# EAGLE design drinkshield01 (EAGLE 5.10)
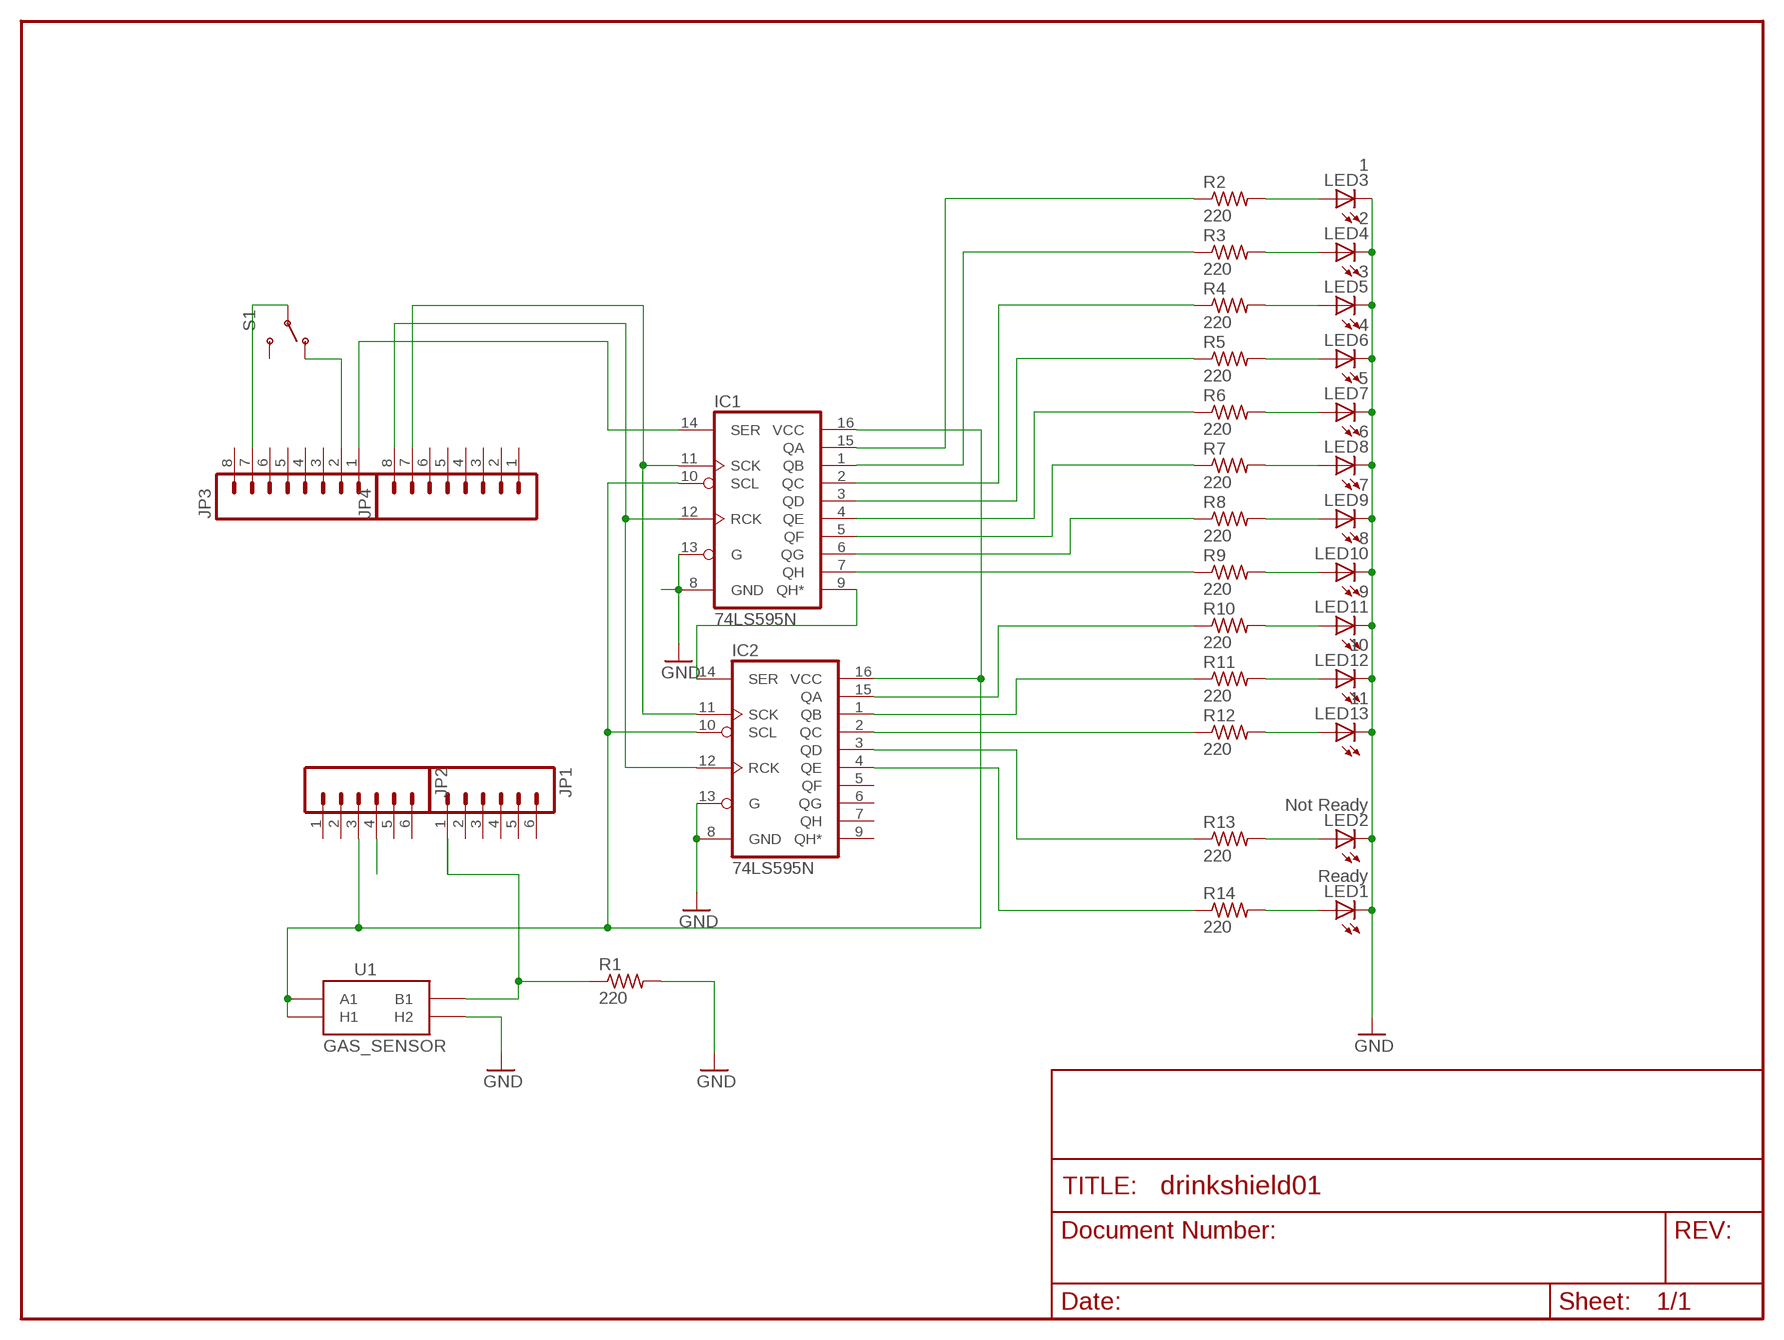
[diagram p0: schematic, sheet 1]

## Parts
IC1  74LS595N  [DIL16]
IC2  74LS595N  [DIL16]
JP1  M06LOCK  [1X06_LOCK]
JP2  M06LOCK  [1X06_LOCK]
JP3  M08LOCK  [1X08_LOCK]
JP4  M08LOCK  [1X08_LOCK]
LED1  Ready  LED5MM  [LED5MM]
LED2  Not Ready  LED5MM  [LED5MM]
LED3  1  LED5MM  [LED5MM]
LED4  2  LED5MM  [LED5MM]
LED5  3  LED5MM  [LED5MM]
LED6  4  LED5MM  [LED5MM]
LED7  5  LED5MM  [LED5MM]
LED8  6  LED5MM  [LED5MM]
LED9  7  LED5MM  [LED5MM]
LED10  8  LED5MM  [LED5MM]
LED11  9  LED5MM  [LED5MM]
LED12  10  LED5MM  [LED5MM]
LED13  11  LED5MM  [LED5MM]
R1  220  R-US_0207/10  [0207/10]
R2  220  R-US_0207/10  [0207/10]
R3  220  R-US_0207/10  [0207/10]
R4  220  R-US_0207/10  [0207/10]
R5  220  R-US_0207/10  [0207/10]
R6  220  R-US_0207/10  [0207/10]
R7  220  R-US_0207/10  [0207/10]
R8  220  R-US_0207/10  [0207/10]
R9  220  R-US_0207/10  [0207/10]
R10  220  R-US_0207/10  [0207/10]
R11  220  R-US_0207/10  [0207/10]
R12  220  R-US_0207/10  [0207/10]
R13  220  R-US_0207/10  [0207/10]
R14  220  R-US_0207/10  [0207/10]
S1  SWITCH-SPSTPTH  [SWITCH-SPDT]
U1  GAS_SENSOR  [MQ-3]

## Nets
GND: IC1.8(GND) IC1.13(G) IC2.8(GND) IC2.13(G) JP2.4 JP3.7 LED1.K(C) LED2.K(C) LED3.K(C) LED4.K(C) LED5.K(C) LED6.K(C) LED7.K(C) LED8.K(C) LED9.K(C) LED10.K(C) LED11.K(C) LED12.K(C) LED13.K(C) R1.2 S1.2(P) U1.HB(H2)
N$1: LED13.A R12.2
N$2: LED12.A R11.2
N$3: LED11.A R10.2
N$4: LED10.A R9.2
N$5: LED9.A R8.2
N$6: LED8.A R7.2
N$7: LED7.A R6.2
N$8: LED6.A R5.2
N$9: LED5.A R4.2
N$10: LED4.A R3.2
N$11: LED3.A R2.2
N$12: IC2.15(QA) R10.1
N$13: IC2.1(QB) R11.1
N$14: IC1.1(QB) R3.1
N$15: LED1.A R14.2
N$16: IC1.14(SER) JP3.1
N$17: IC1.9(QH*) IC2.14(SER)
N$18: IC1.12(RCK) IC2.12(RCK) JP4.8
N$19: IC1.11(SCK) IC2.11(SCK) JP4.7
N$20: IC1.6(QG) R8.1
N$21: LED2.A R13.2
N$23: IC1.15(QA) R2.1
N$24: IC1.2(QC) R4.1
N$25: IC1.3(QD) R5.1
N$26: IC1.4(QE) R6.1
N$27: IC1.5(QF) R7.1
N$28: JP1.1 R1.1 U1.B1
N$29: IC1.7(QH) R9.1
N$30: JP3.2 S1.1(O)
N$31: IC2.2(QC) R12.1
N$32: IC2.3(QD) R13.1
N$33: IC2.4(QE) R14.1
VCC: IC1.10(SCL) IC1.16(VCC) IC2.10(SCL) IC2.16(VCC) JP2.3 U1.A1 U1.HA(H1)
Unconnected: IC2.5(QF) IC2.6(QG) IC2.7(QH) IC2.9(QH*) JP1.2 JP1.3 JP1.4 JP1.5 JP1.6 JP2.1 JP2.2 JP2.5 JP2.6 JP3.3 JP3.4 JP3.5 JP3.6 JP3.8 JP4.1 JP4.2 JP4.3 JP4.4 JP4.5 JP4.6 S1.3(S)

## Library data of the parts
IC1 IC2 = SparkFun:74*595: 8-bit SHIFT REGISTER, output latch
JP1 JP2 = SparkFun:M06: Header 6 Standard 6-pin 0.1" header. Use with straight break away headers (SKU : PRT-00116), right angle break away headers (PRT-00553), swiss pins (PRT-00743), machine pins (PRT-00117), and female headers (PRT-00115). Molex polarized connector foot print use with SKU : PRT-08094 with associated crimp pins and housings. NOTES ON THE VARIANTS LOCK and LOCK_LONGPADS... This footprint was designed to help hold the alignment of a through-hole component (i.e. 6-pin header) while soldering it into place. You may notice that each hole has been shifted either up or down by 0.005 of an inch from it's more standard position (which is a perfectly straight line). This slight alteration caused the pins (the squares in the middle) to touch the edges of the holes. Because they are alternating, it causes a "brace" to hold the component in place. 0.005 has proven to be the perfect amount of "off-center" position when using our standard breakaway headers. Although looks a little odd when you look at the bare footprint, once you have a header in there, the alteration is very hard to notice. Also, if you push a header all the way into place, it is covered up entirely on the bottom side. This idea of altering the position of holes to aid alignment will be further integrated into the Sparkfun Library for other footprints. It can help hold any component with 3 or more connection pins.
JP3 JP4 = SparkFun:M08: Header 8 Standard 8-pin 0.1" header. Use with straight break away headers (SKU : PRT-00116), right angle break away headers (PRT-00553), swiss pins (PRT-00743), machine pins (PRT-00117), and female headers (PRT-00115).
LED1-LED13 = adafruit:LED: LED OSRAM: - CHIPLED LG R971, LG N971, LY N971, LG Q971, LY Q971, LO R971, LY R971 LH N974, LH R974 LS Q976, LO Q976, LY Q976 LO Q996 - Hyper CHIPLED LW Q18S LB Q993, LB Q99A, LB R99A - SideLED LS A670, LO A670, LY A670, LG A670, LP A670 LB A673, LV A673, LT A673, LW A673 LH A674 LY A675 LS A676, LA A676, LO A676, LY A676, LW A676 LS A679, LY A679, LG A679 - Hyper Micro SIDELED® LS Y876, LA Y876, LO Y876, LY Y876 LT Y87S - SmartLED LW L88C, LW L88S LB L89C, LB L89S, LG L890 LS L89K, LO L89K, LY L89K LS L896, LA L896, LO L896, LY L896 - TOPLED LS T670, LO T670, LY T670, LG T670, LP T670 LSG T670, LSP T670, LSY T670, LOP T670, LYG T670 LG T671, LOG T671, LSG T671 LB T673, LV T673, LT T673, LW T673 LH T674 LS T676, LA T676, LO T676, LY T676, LB T676, LH T676, LSB T676, LW T676 LB T67C, LV T67C, LT T67C, LS T67K, LO T67K, LY T67K, LW E67C LS E67B, LA E67B, LO E67B, LY E67B, LB E67C, LV E67C, LT E67C LW T67C LS T679, LY T679, LG T679 LS T770, LO T770, LY T770, LG T770, LP T770 LB T773, LV T773, LT T773, LW T773 LH T774 LS E675, LA E675, LY E675, LS T675 LS T776, LA T776, LO T776, LY T776, LB T776 LHGB T686 LT T68C, LB T68C - Hyper Mini TOPLED® LB M676 - Mini TOPLED Santana® LG M470 LS M47K, LO M47K, LY M47K Source: http://www.osram.convergy.de/
R1-R14 = adafruit:R-US_: RESISTOR, American symbol
S1 = SparkFun:SWITCH-SPST: SPST Switch Simple slide switch. Spark Fun Electronics SKU : COM-00102
U1 = SparkFun:GAS_SENSOR: MQ-3 Gas Sensor. FP not tested. Part#

## Board
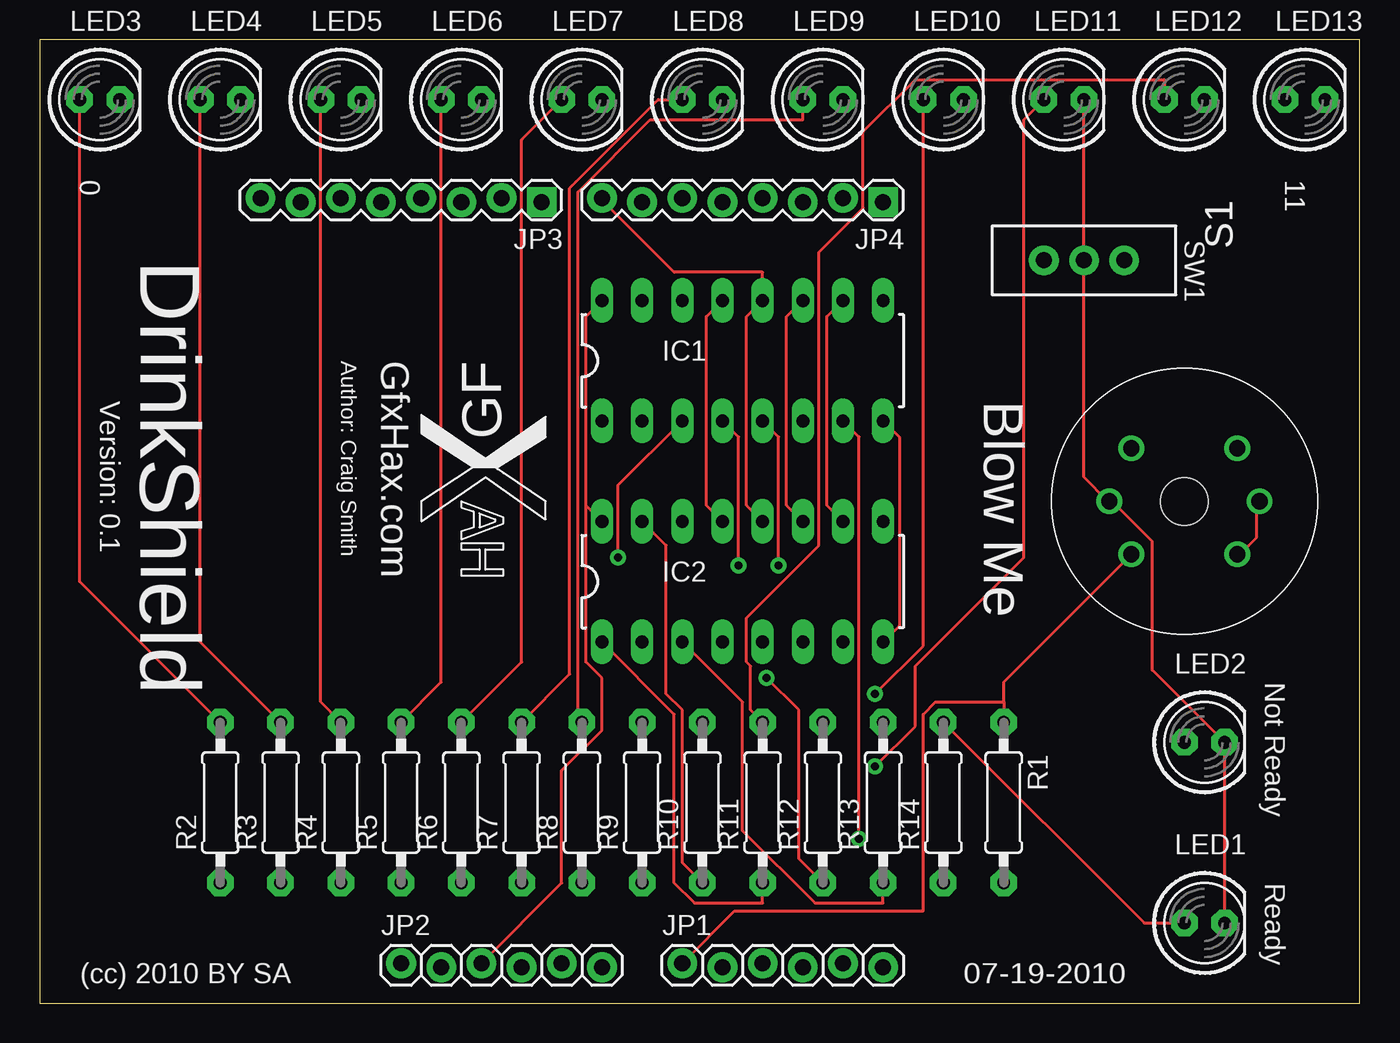
[diagram p1: board, top side]
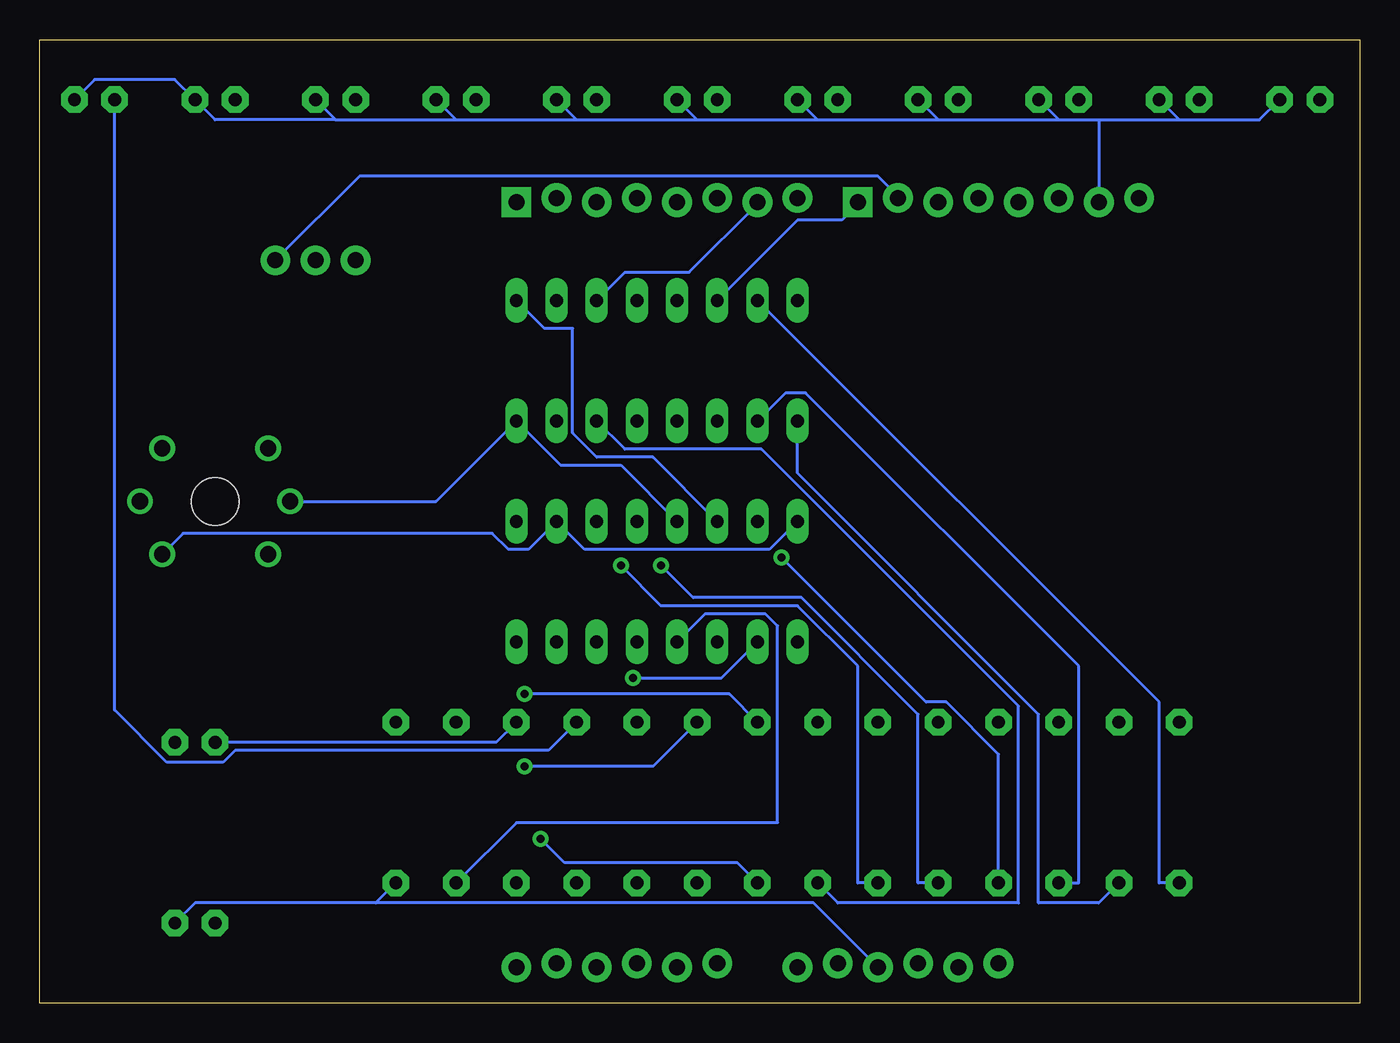
[diagram p2: board, bottom side, seen from below]

Size 83.49 x 60.95 mm. Coordinates in mm from the lower left corner, seen from the top.
Outline: 0,0 83.49,0 83.49,60.95 0,60.95 0,0
Copper layers (1*16): Top 0.035mm / dielectric 1.5mm / Bottom 0.035mm
Design rules "SparkFun": minimum track width 8mil, minimum drill 20mil, track to track 8mil, track to pad 8mil, pad to pad 8mil, via to via 8mil, smd to smd 8mil, copper to edge 10mil, drill to drill 8mil, minimum pad ring 12mil, minimum via ring 10mil, stop-mask expansion 4mil, vias tented up to drill 25mil, thermal gap 10mil

### Footprints (pad centres in the part's own frame; a part is rotated, then mirrored left to right if it is on the bottom)
DIL16 = drill 0.813 long: 1 -8.89,-3.81; 2 -6.35,-3.81; 3 -3.81,-3.81; 4 -1.27,-3.81; 5 1.27,-3.81; 6 3.81,-3.81; 7 6.35,-3.81; 8 8.89,-3.81; 9 8.89,3.81; 10 6.35,3.81; 11 3.81,3.81; 12 1.27,3.81; 13 -1.27,3.81; 14 -3.81,3.81; 15 -6.35,3.81; 16 -8.89,3.81
1X06_LOCK = drill 1.016 pad 1.88 round: 1 0,0; 2 2.54,-0.254; 3 5.08,0; 4 7.62,-0.254; 5 10.16,0; 6 12.7,-0.254
1X08_LOCK = drill 1.016 pad 1.88 square: 1 0,0.127 | drill 1.016 pad 1.88 round: 2 2.54,-0.127; 3 5.08,0.127; 4 7.62,-0.127; 5 10.16,0.127; 6 12.7,-0.127; 7 15.24,0.127; 8 17.78,-0.127
LED5MM = drill 0.813 pad 1.676 octagon: A -1.27,0; K 1.27,0
0207/10 = drill 0.813 pad 1.676 octagon: 1 -5.08,0; 2 5.08,0
SWITCH-SPDT = drill 1.016 pad 1.88 round: 1 0,2.54; 2 0,0; 3 0,-2.54
MQ-3 = drill 1.016 round: A1 -3.35,3.35; A2 -3.35,-3.35; B1 3.35,3.35; B2 3.35,-3.35; HA -4.75,0; HB 4.75,0 | hole 3: 0,0

### Placement (x,y rotation side)
IC1  44.45,40.64 0 top
IC2  44.45,26.67 0 top
JP1  40.64,2.54 0 top
JP2  22.86,2.54 0 top
JP3  31.75,50.8 180 top
JP4  53.34,50.8 180 top
LED1  73.66,5.08 0 top
LED2  73.66,16.51 0 top
LED3  3.81,57.15 0 top
LED4  11.43,57.15 0 top
LED5  19.05,57.15 0 top
LED6  26.67,57.15 0 top
LED7  34.29,57.15 0 top
LED8  41.91,57.15 0 top
LED9  49.53,57.15 0 top
LED10  57.15,57.15 0 top
LED11  64.77,57.15 0 top
LED12  72.39,57.15 0 top
LED13  80.01,57.15 0 top
R1  60.96,12.7 270 top
R2  11.43,12.7 90 top
R3  15.24,12.7 90 top
R4  19.05,12.7 90 top
R5  22.86,12.7 90 top
R6  26.67,12.7 90 top
R7  30.48,12.7 90 top
R8  34.29,12.7 90 top
R9  38.1,12.7 90 top
R10  41.91,12.7 90 top
R11  45.72,12.7 90 top
R12  49.53,12.7 90 top
R13  53.34,12.7 90 top
R14  57.15,12.7 90 top
S1  66.04,46.99 270 top
U1  72.39,31.75 180 top
U$1  [GFXHAX_LOGO]  26.67,40.64 270 top

### Tracks (layer width: path | path; a pad name or v marks a point on that pad's centre or on a via)
GND
  Top 0.203: LED1.K LED2.K 70.36,21.08 70.36,29.21 67.82,31.75 U1.HB 67.56,31.75 66.04,33.27 S1.2 LED11.K | IC2.8 54.36,23.88 54.36,35.81 IC1.8 | IC1.13 42.16,43.43 42.16,31.5 IC2.13
  Bottom 0.203: 62.23,6.35 R1.2 | 62.23,6.35 73.66,6.35 LED1.K | JP2.4 34.54,6.35 62.23,6.35 | IC2.13 46.74,34.04 50.55,34.04 IC1.8 58.42,31.75 U1.HB | LED3.K 6.35,55.88 11.43,55.88 | 11.43,55.88 LED4.K | 19.05,55.88 LED5.K | 16.51,55.88 11.43,55.88 | 19.05,55.88 16.51,55.88 | 26.67,55.88 LED6.K | 26.67,55.88 19.05,55.88 | 34.29,55.88 LED7.K | 34.29,55.88 26.67,55.88 | 41.91,55.88 LED8.K | 41.91,55.88 34.29,55.88 | 49.53,55.88 LED9.K | 49.53,55.88 41.91,55.88 | 57.15,55.88 LED10.K | 57.15,55.88 49.53,55.88 | LED11.K 64.77,55.88 | 64.77,55.88 57.15,55.88 | 64.77,55.88 72.39,55.88 LED12.K 74.93,58.42 80.01,58.42 LED13.K | 16.51,55.88 JP3.7
N$1
  Bottom 0.203: R12.2 51.31,16 71.12,16 71.88,15.24 75.44,15.24 78.74,18.54 LED13.A
N$2
  Top 0.203: R11.2 44.96,18.54 44.96,21.34 44.7,21.59 44.7,24.38 49.28,28.96 49.28,47.5 52.07,50.29 52.07,55.12 55.37,58.42 71.12,58.42 LED12.A
N$3  (via drill 0.51)
  Top 0.203: v52.83,14.99 55.37,17.53 55.37,21.34 62.23,28.19 62.23,55.88 LED11.A
  Bottom 0.203: R10.2 44.7,14.99 v52.83,14.99
N$4  (via drill 0.51)
  Top 0.203: v52.83,19.56 55.88,22.61 LED10.A
  Bottom 0.203: R9.2 39.88,19.56 v52.83,19.56
N$5
  Top 0.203: R8.2 34.04,18.03 34.04,51.31 38.61,55.88 48.26,55.88 LED9.A
N$6
  Top 0.203: R7.2 33.53,20.83 33.53,51.56 39.12,57.15 LED8.A
N$7
  Top 0.203: R6.2 30.48,21.59 30.48,54.61 LED7.A
N$8
  Top 0.203: R5.2 25.4,20.32 LED6.A
N$9
  Top 0.203: R4.2 17.78,19.05 LED5.A
N$10
  Top 0.203: R3.2 10.16,22.86 LED4.A
N$11
  Top 0.203: R2.2 2.54,26.67 LED3.A
N$12
  Top 0.203: IC2.15 39.62,28.96 39.62,19.56 40.64,18.54 40.64,8.89 R10.1
N$13
  Top 0.203: IC2.1 40.13,18.29 40.13,7.62 41.4,6.35 45.72,6.35 R11.1
N$14
  Bottom 0.203: IC1.1 35.56,33.53 20.32,18.29 20.32,6.35 16.51,6.35 R3.1
N$15
  Top 0.203: R14.2 69.85,5.08 LED1.A
N$16
  Bottom 0.203: IC1.14 35.56,49.53 32.77,49.53 31.75,50.55 JP3.1
N$17
  Bottom 0.203: IC2.14 44.7,34.54 48.26,34.54 49.78,36.07 49.78,42.67 51.56,42.67 IC1.9
N$18
  Top 0.203: IC2.12 44.7,31.5 44.7,43.43 IC1.12 45.72,46.23 40.13,46.23 35.56,50.8 JP4.8
N$19
  Top 0.203: IC2.11 47.24,31.5 47.24,43.43 IC1.11
  Bottom 0.203: IC1.11 46.48,46.23 42.42,46.23 38.1,50.55 JP4.7
N$20
  Bottom 0.203: IC1.6 46.48,35.05 37.85,35.05 21.59,18.8 21.59,6.35 33.02,6.35 R8.1
N$21
  Bottom 0.203: R13.2 54.61,16.51 LED2.A
N$23
  Bottom 0.203: IC1.15 12.7,19.05 12.7,7.62 R2.1
N$24
  Bottom 0.203: IC1.2 36.32,38.61 35.05,38.61 17.78,21.34 17.78,7.62 R4.1
N$25  (via drill 0.51)
  Top 0.203: IC1.3 36.58,32.77 v36.58,28.19
  Bottom 0.203: v36.58,28.19 27.43,19.05 26.16,19.05 22.86,15.75 R5.1
N$26  (via drill 0.51)
  Top 0.203: IC1.4 44.2,35.81 v44.2,27.69
  Bottom 0.203: v44.2,27.69 42.16,25.65 35.31,25.65 27.94,18.29 27.94,7.62 R6.1
N$27  (via drill 0.51)
  Top 0.203: IC1.5 46.74,35.81 v46.74,27.69
  Bottom 0.203: v46.74,27.69 44.2,25.15 35.56,25.15 31.75,21.34 31.75,7.62 R7.1
N$28
  Top 0.203: 60.96,19.05 R1.1 | 60.96,19.05 60.96,20.32 U1.B1 | JP1.1 43.94,5.84 55.88,5.84 55.88,18.29 56.64,19.05 60.96,19.05
N$29  (via drill 0.51)
  Top 0.203: IC1.7 51.82,35.81 v51.82,10.41
  Bottom 0.203: v51.82,10.41 50.29,8.89 39.37,8.89 R9.1
N$30
  Bottom 0.203: S1.1 63.25,52.32 30.48,52.32 29.21,51.05 JP3.2
N$31  (via drill 0.51)
  Top 0.203: v45.97,20.57 48.01,18.54 48.01,9.14 R12.1
  Bottom 0.203: IC2.2 40.39,20.57 v45.97,20.57
N$32
  Top 0.203: IC2.3 44.45,19.05 44.45,10.92 49.02,6.35 53.34,6.35 R13.1
N$33
  Bottom 0.203: IC2.4 41.4,24.64 37.59,24.64 36.83,23.88 36.83,11.43 53.34,11.43 R14.1
VCC
  Top 0.203: U1.A1 75.95,28.45 76.96,29.46 76.96,31.75 U1.HA | IC2.10 49.78,31.5 49.78,43.43 IC1.10 | 34.54,31.5 IC2.16 | 34.54,31.5 34.54,43.43 IC1.16 | JP2.3 33.02,7.62 33.02,14.73 35.56,17.27 35.56,20.57 34.54,21.59 34.54,31.5
  Bottom 0.203: U1.A1 74.42,29.72 54.86,29.72 53.85,28.7 52.58,28.7 IC2.10 49.02,28.7 37.34,28.7 IC2.16

### Text on the board
tPlace: 0 | 11 | SW1 | DrinkShield | Author: Craig Smith | GfxHax.com | Version: 0.1 | Blow Me | Not Ready | Ready | (cc) 2010 BY SA | 07-19-2010